# Altium schematic sheet ZYNQ-XC7Z020开发板原理图.SCHDOC
size A0
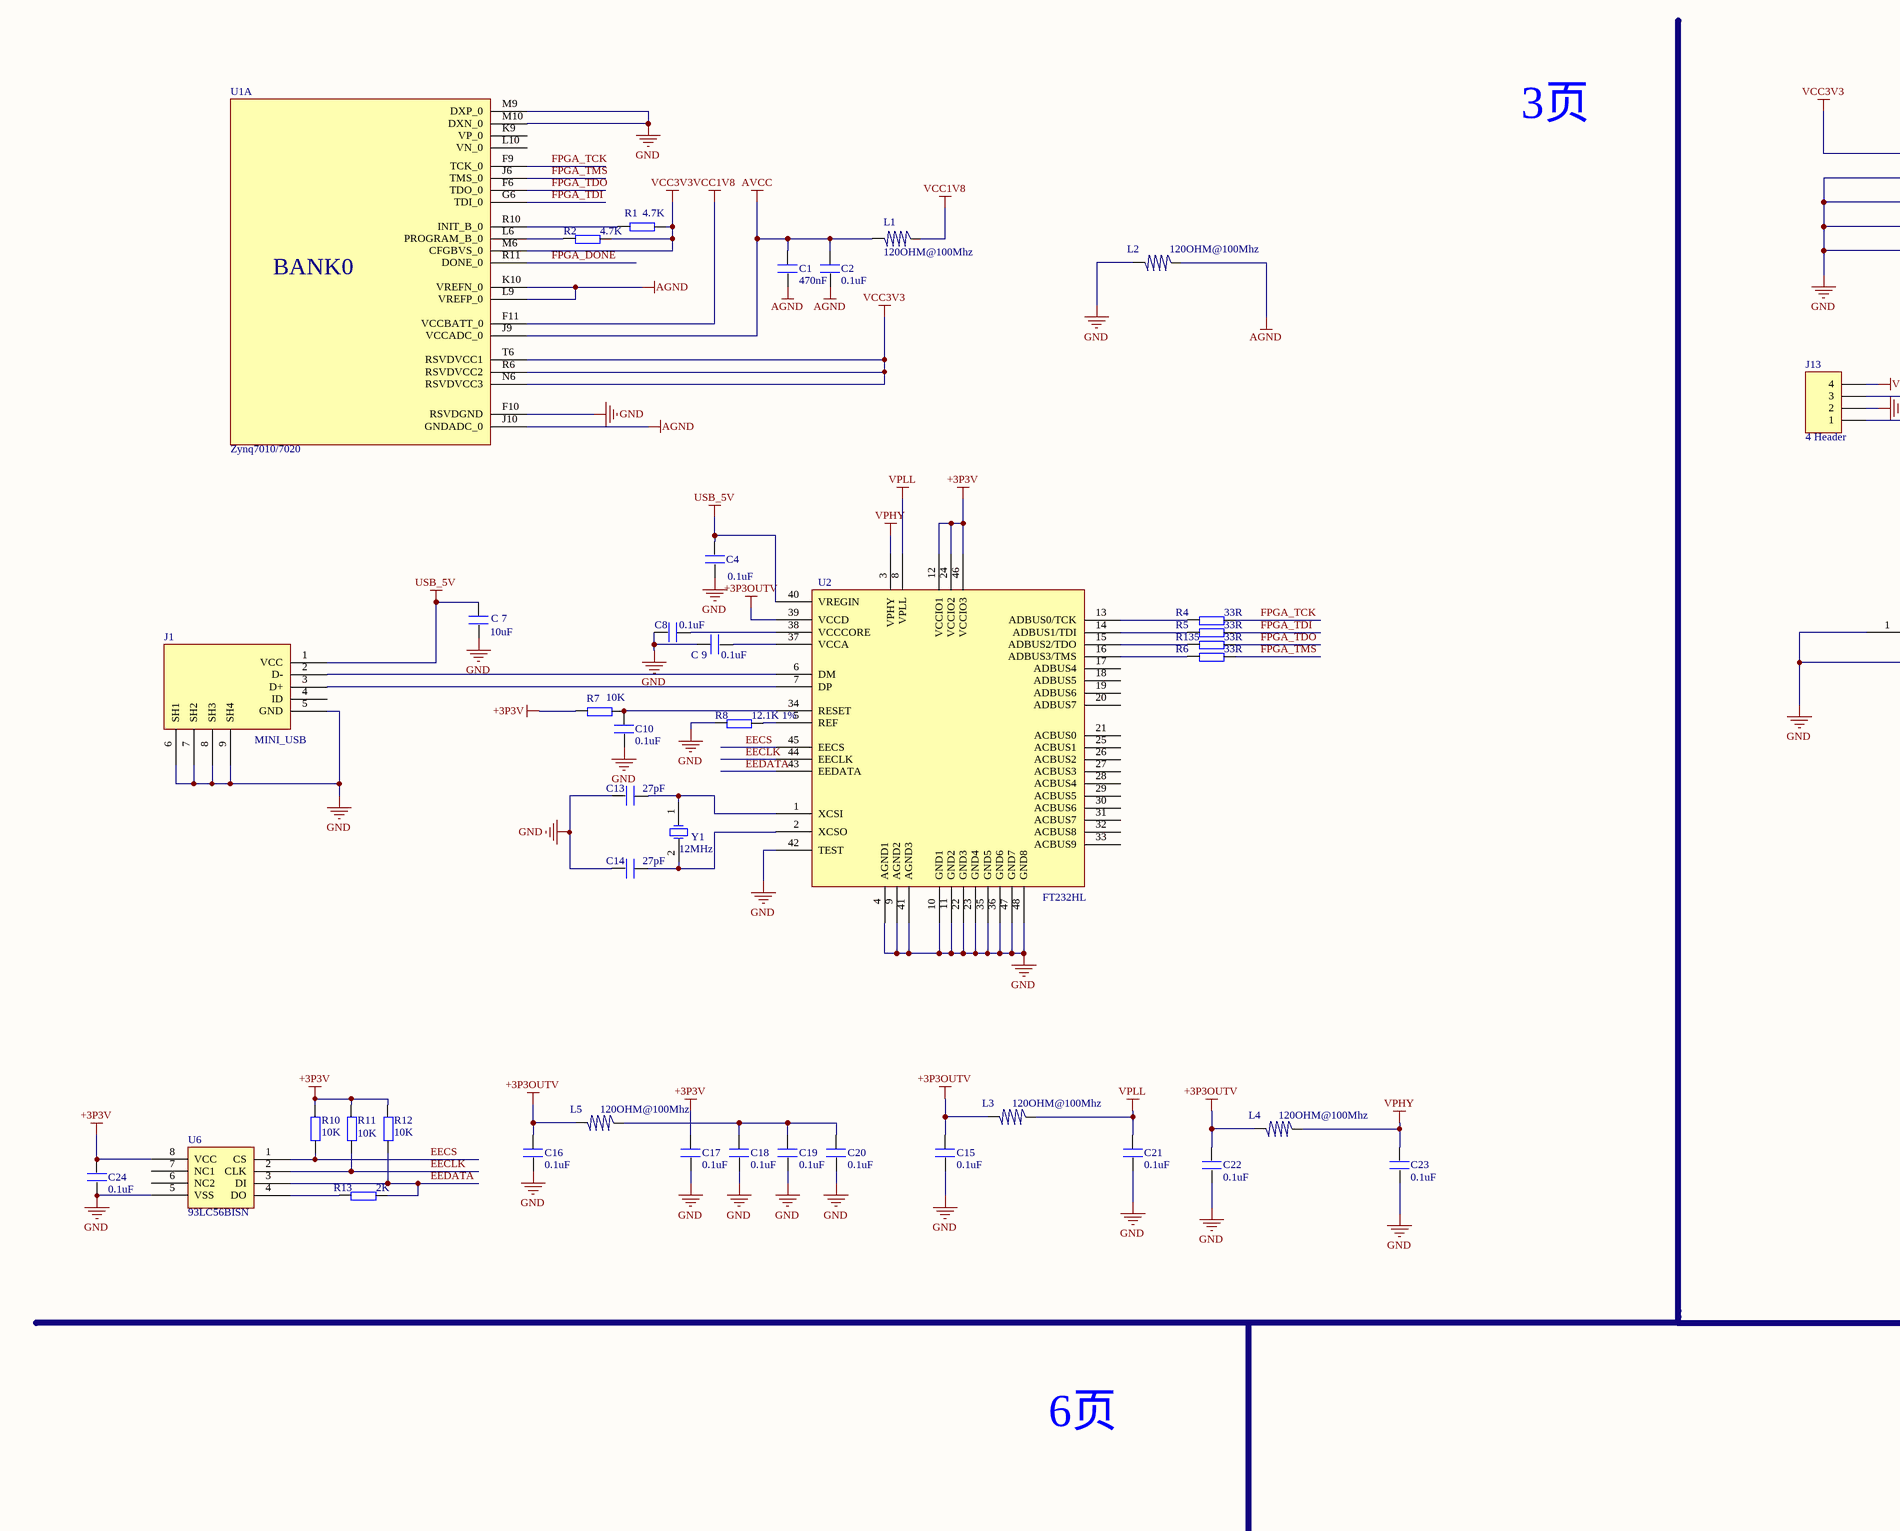
[diagram p0: ZYNQ-XC7Z020开发板原理图.SCHDOC, top left]
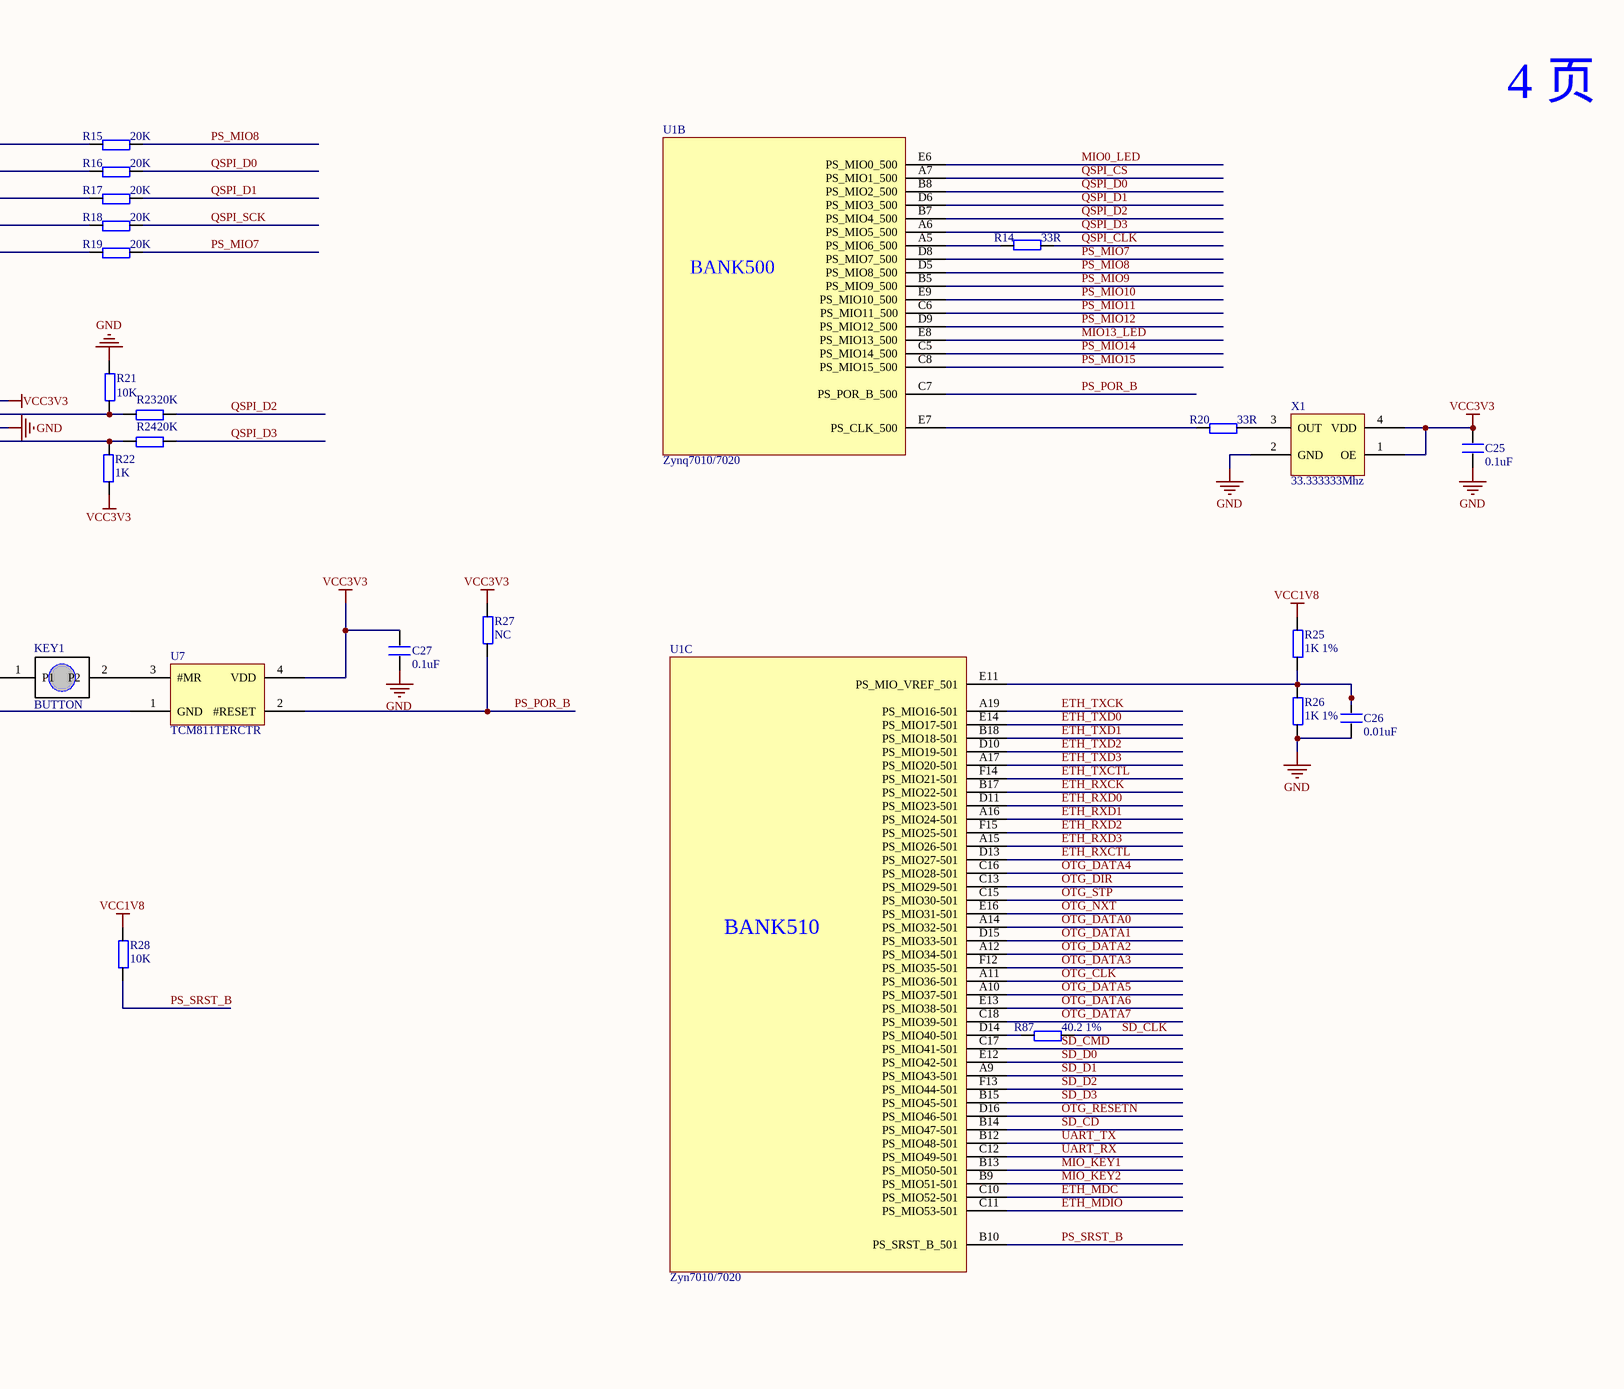
[diagram p1: ZYNQ-XC7Z020开发板原理图.SCHDOC, top middle]
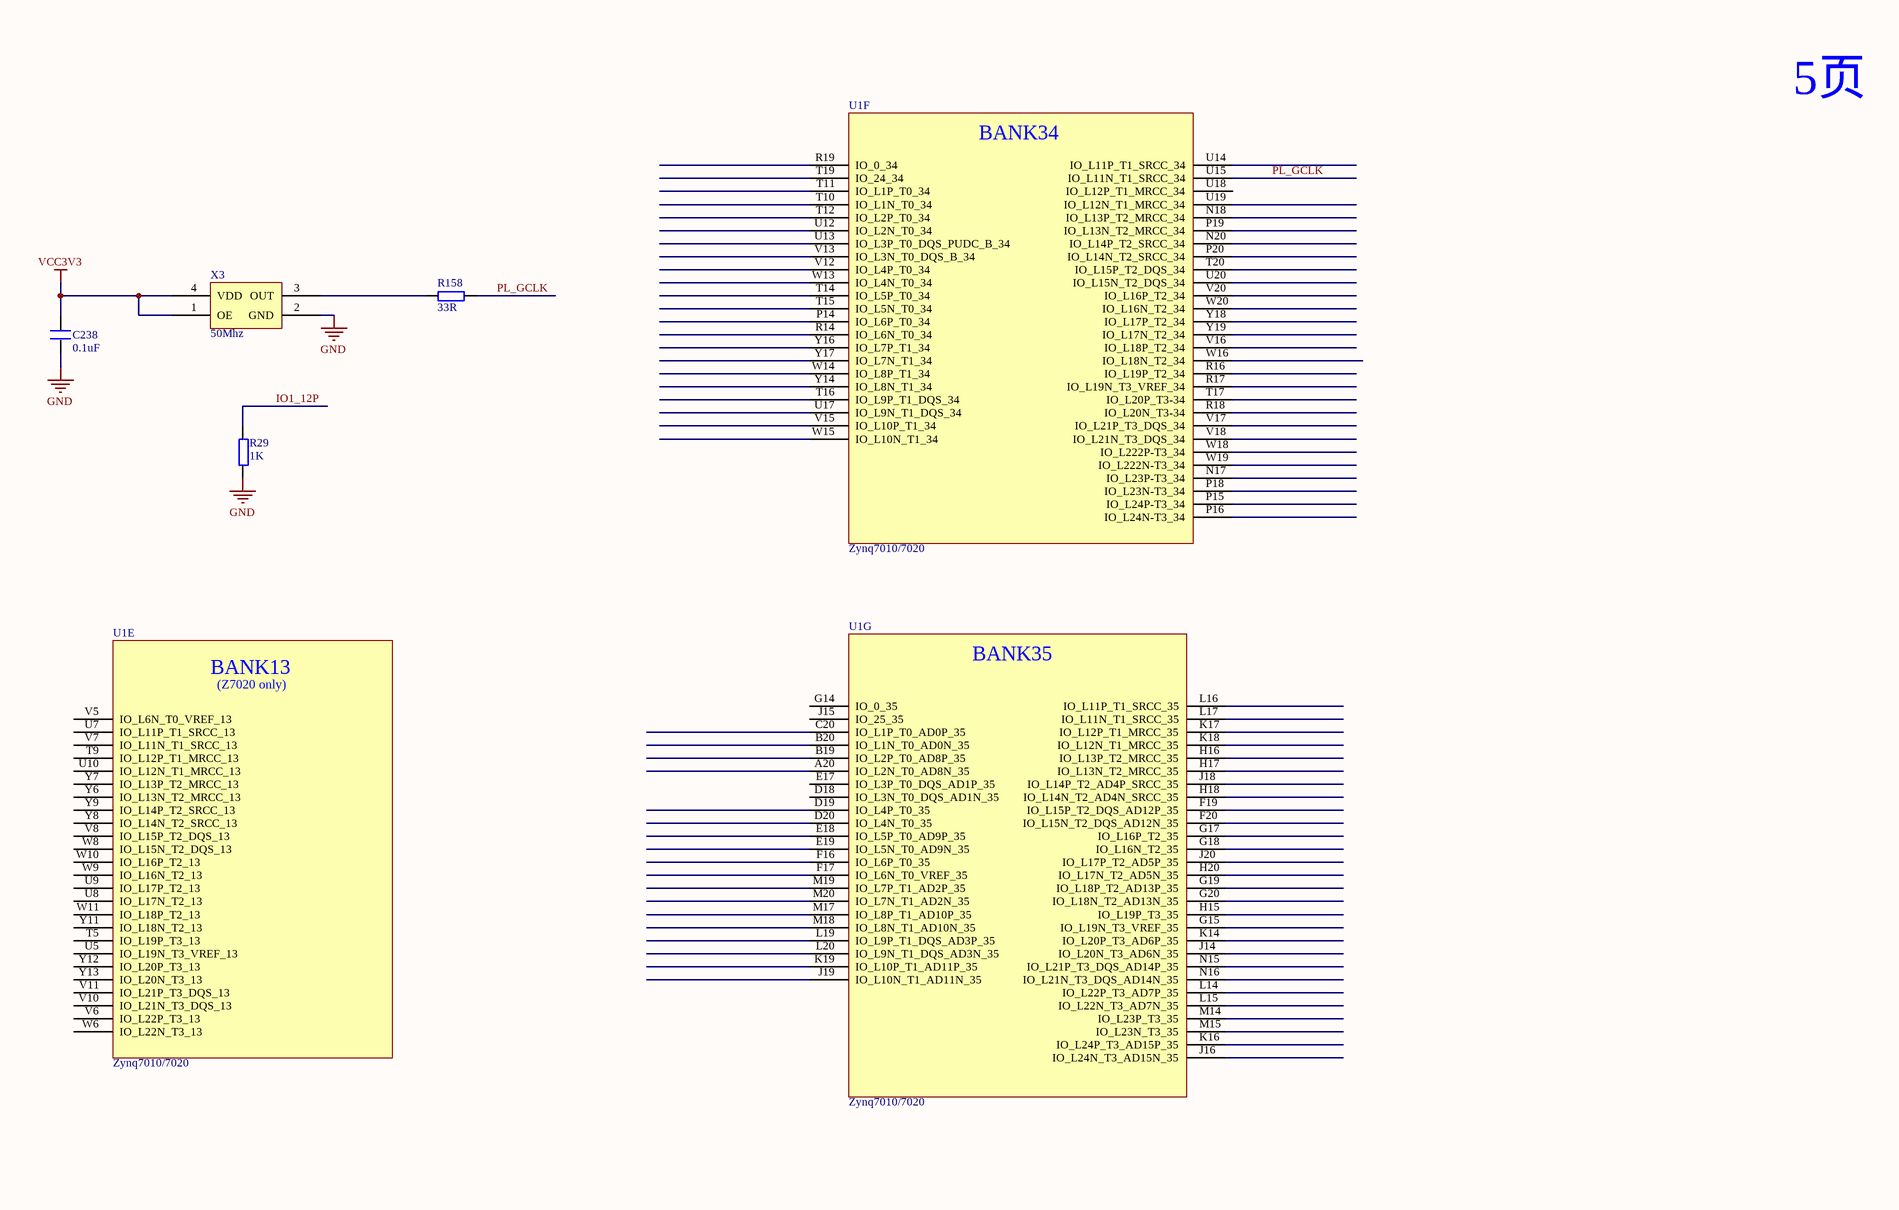
[diagram p2: ZYNQ-XC7Z020开发板原理图.SCHDOC, top right]
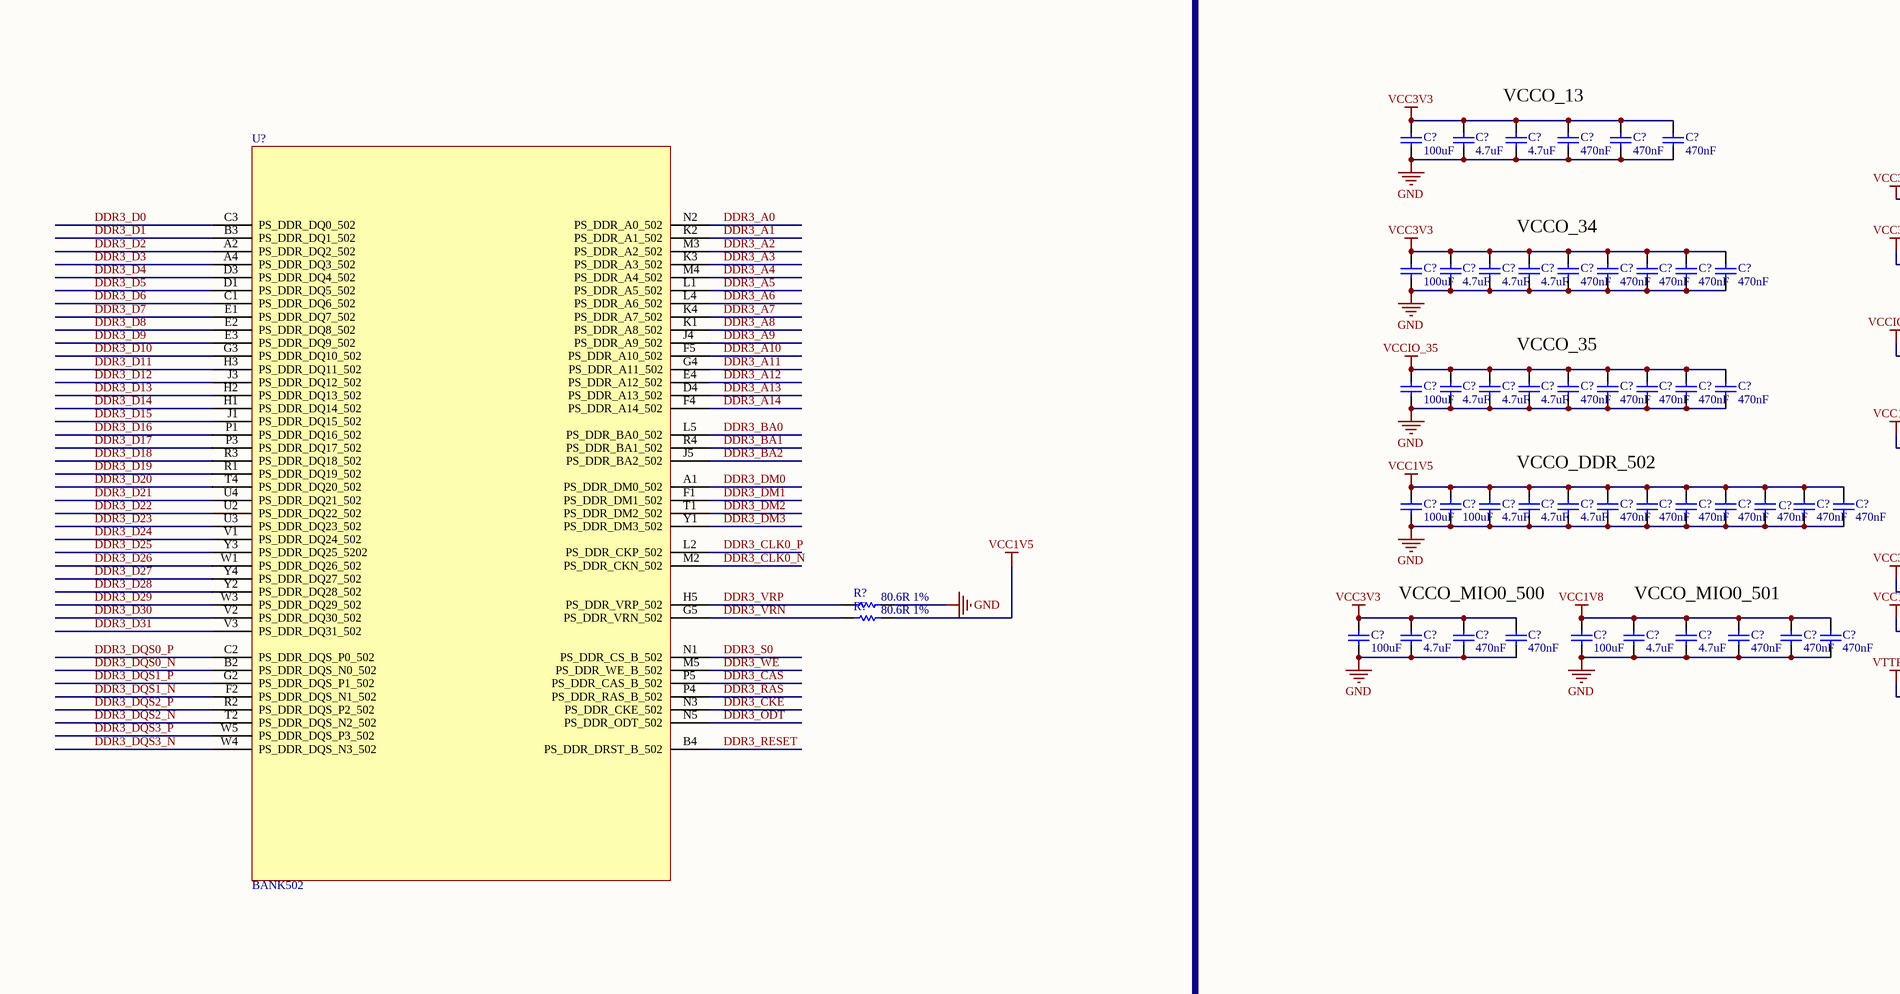
[diagram p3: ZYNQ-XC7Z020开发板原理图.SCHDOC, bottom left]
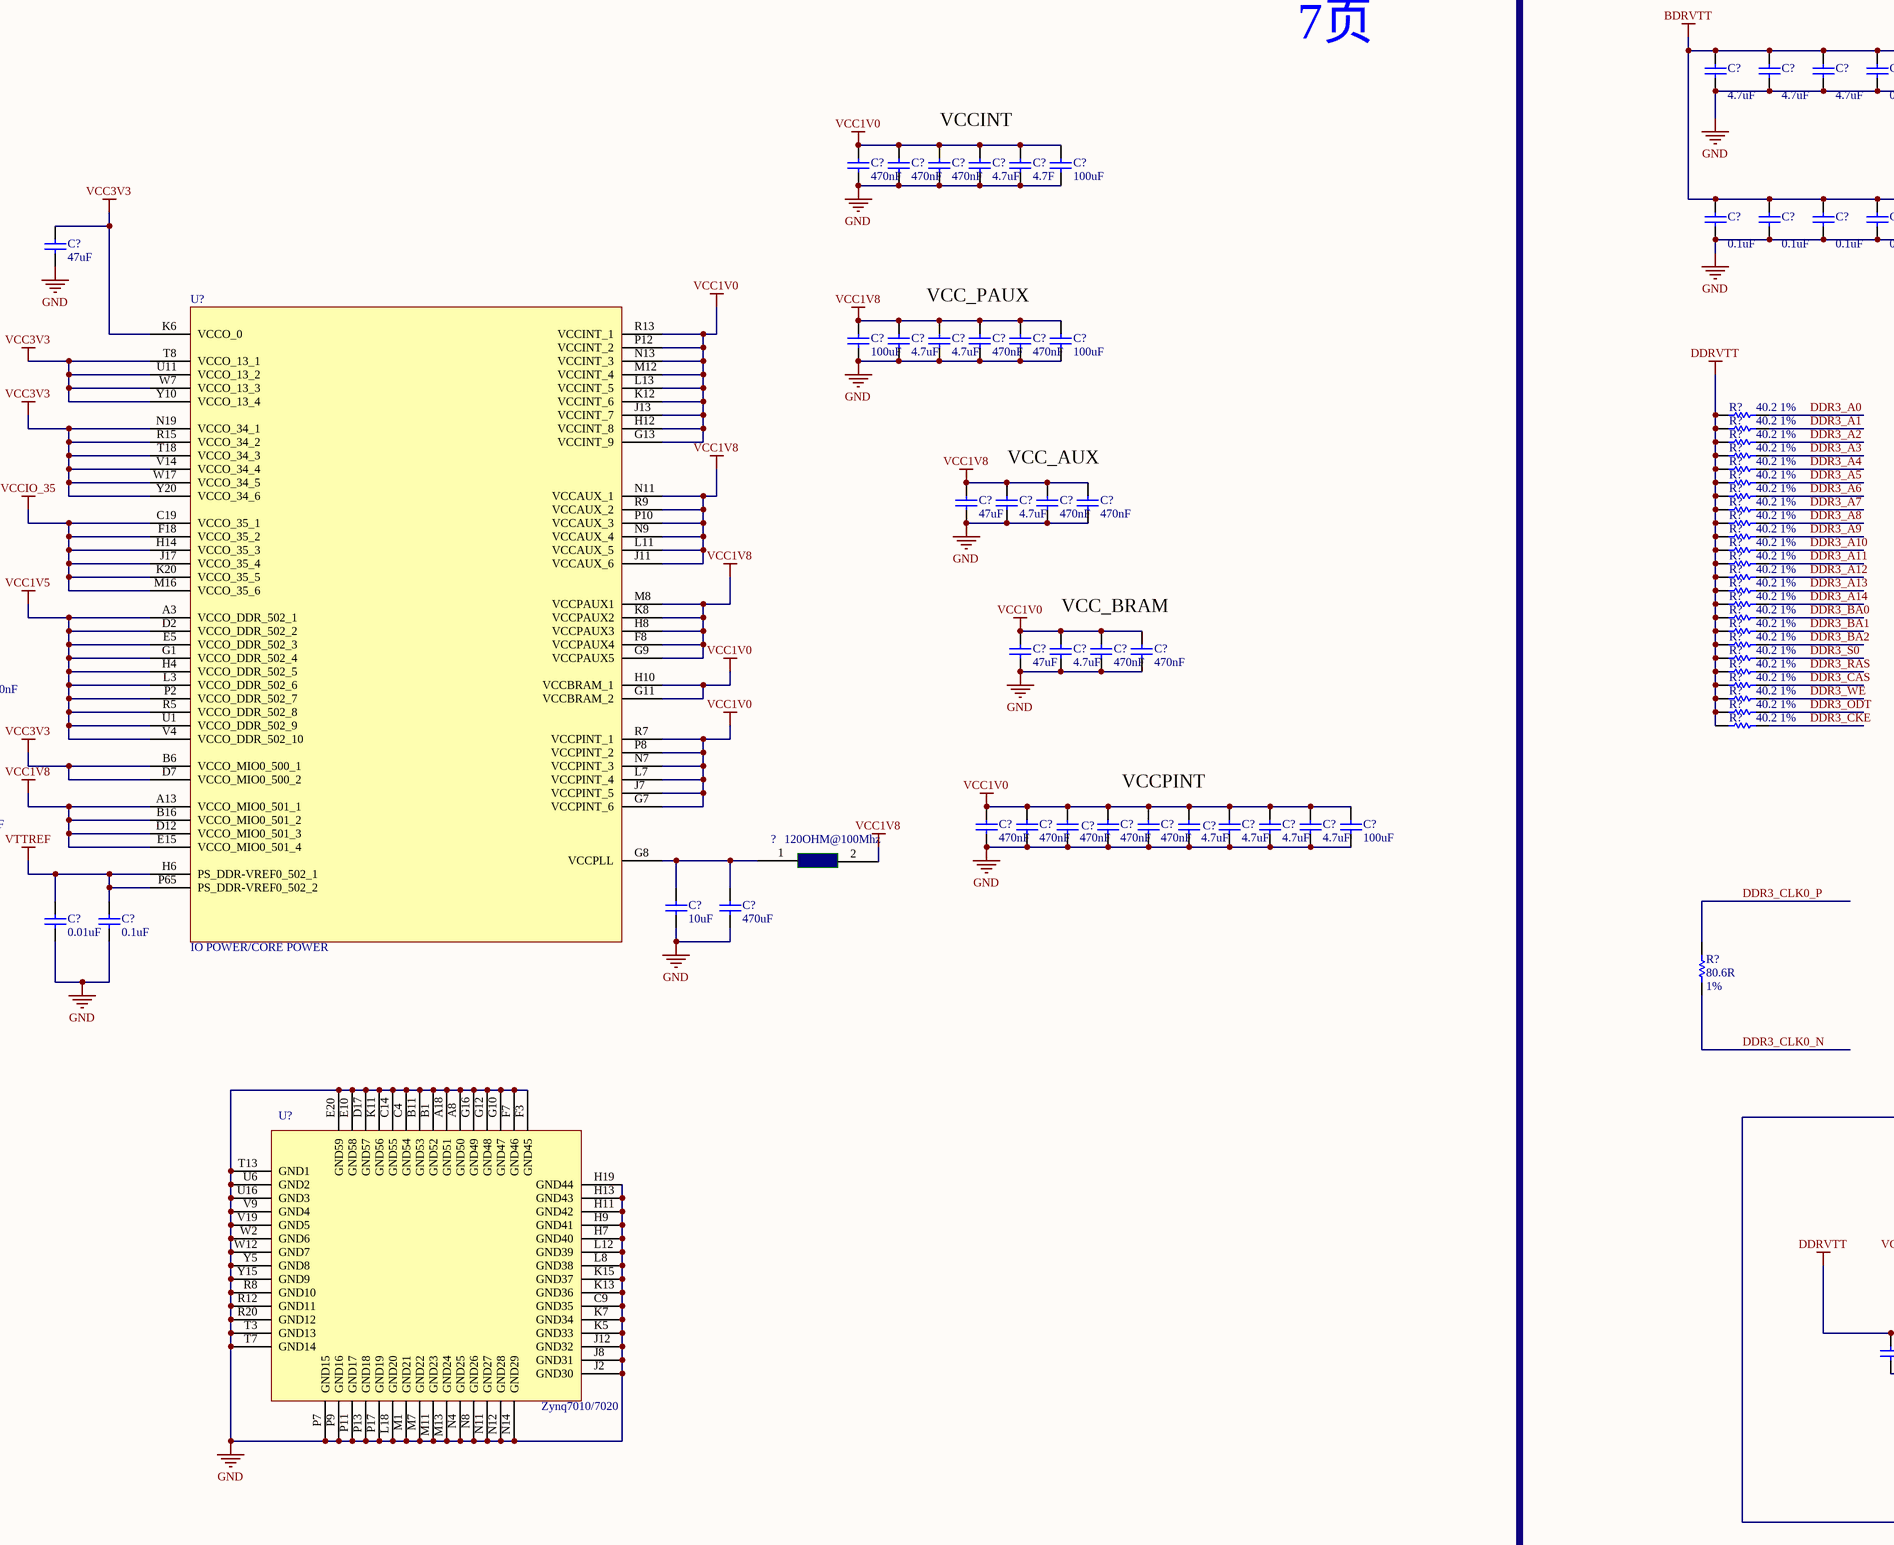
[diagram p4: ZYNQ-XC7Z020开发板原理图.SCHDOC, bottom middle]
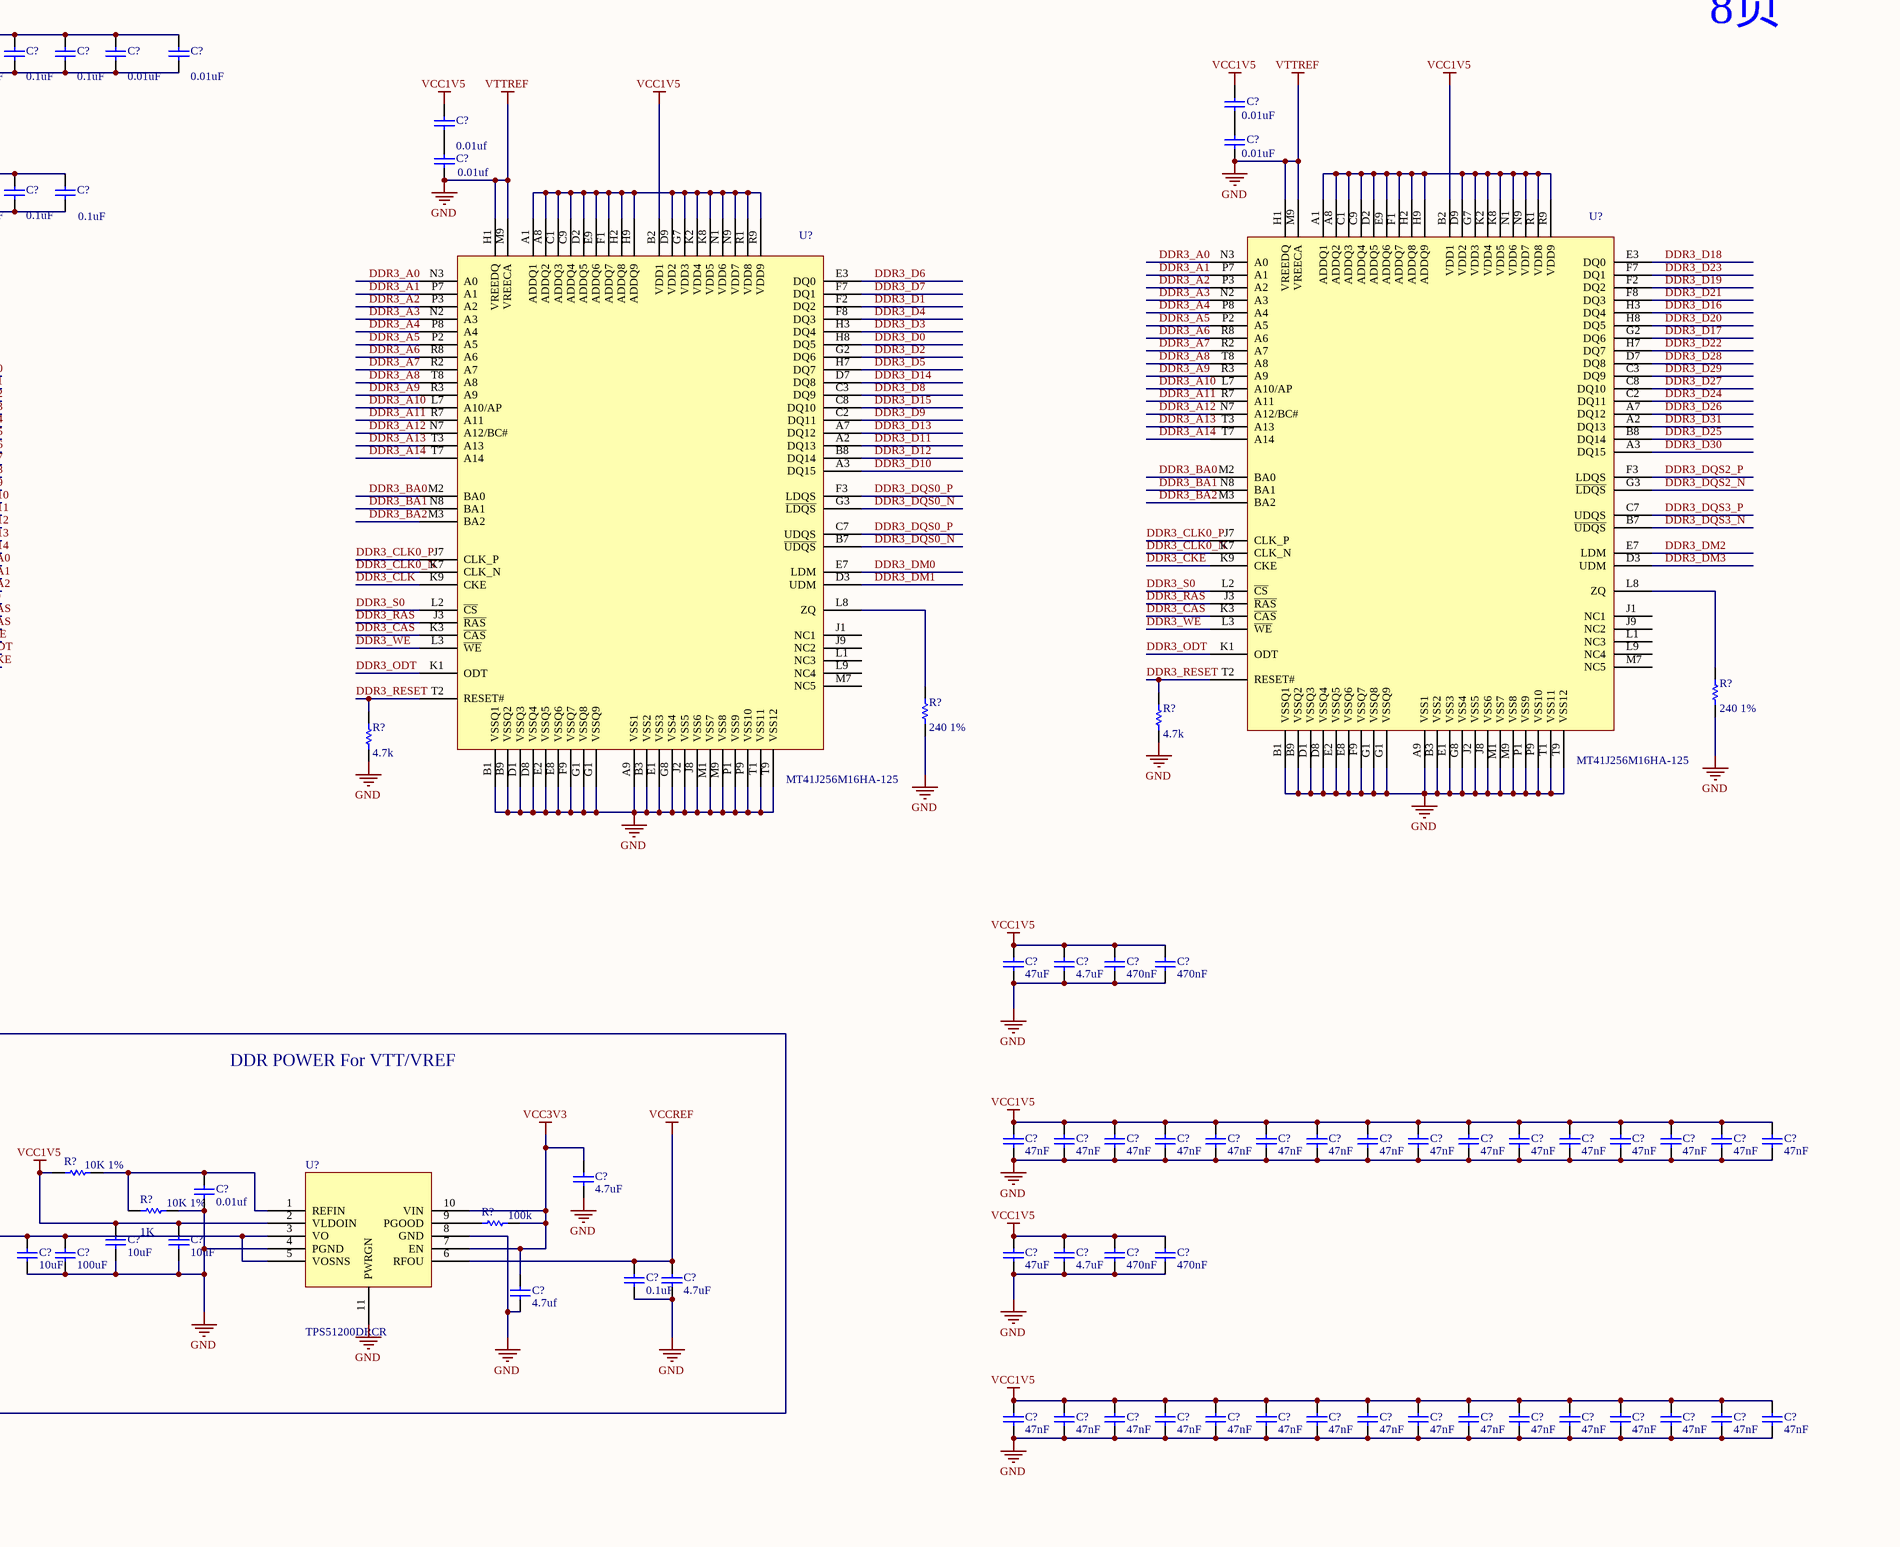
[diagram p5: ZYNQ-XC7Z020开发板原理图.SCHDOC, bottom right]

## Parts
(Parts that share a designator on the sheet are numbered #1, #2 ... from top to bottom, then left to right.)
?  120OHM@100Mhz
C1  470nF  [0603P]
C2  0.1uF  [0603P]
C4  0.1uF  [0603P]
C8  0.1uF  [0603P]
C10  0.1uF  [0603P]
C13  27pF  [0603P]
C14  27pF  [0603P]
C15  0.1uF  [0603P]
C16  0.1uF  [0603P]
C17  0.1uF  [0603P]
C18  0.1uF  [0603P]
C19  0.1uF  [0603P]
C20  0.1uF  [0603P]
C21  0.1uF  [0603P]
C22  0.1uF  [0603P]
C23  0.1uF  [0603P]
C24  0.1uF  [0603P]
C25  0.1uF  [0603P]
C26  0.01uF  [0603P]
C27  0.1uF  [0603P]
C238  0.1uF  [0603P]
C?#1  value 4.7uF  [RAD-0.3]
C?#2  value 4.7uF  [RAD-0.3]
C?#3  value 4.7uF  [RAD-0.3]
C?#4  value 0.1uF  [RAD-0.3]
C?#5  value 0.1uF  [RAD-0.3]
C?#6  value 0.01uF  [RAD-0.3]
C?#7  value 0.01uF  [RAD-0.3]
C?#8  value 0.01uF  [RAD-0.3]
C?#9  value 0.01uf  [RAD-0.3]
C?#10  470nF  [RAD-0.3]
C?#11  470nF  [RAD-0.3]
C?#12  470nF  [RAD-0.3]
C?#13  4.7uF  [RAD-0.3]
C?#14  4.7F  [RAD-0.3]
C?#15  100uF  [RAD-0.3]
C?#16  value 0.01uF  [RAD-0.3]
C?#17  value 0.01uf  [RAD-0.3]
C?#18  value 0.1uF  [RAD-0.3]
C?#19  value 0.1uF  [RAD-0.3]
C?#20  value 0.1uF  [RAD-0.3]
C?#21  value 0.1uF  [RAD-0.3]
C?#22  value 0.1uF  [RAD-0.3]
C?#23  47uF  [RAD-0.3]
C?#24  100uF  [RAD-0.3]
C?#25  4.7uF  [RAD-0.3]
C?#26  4.7uF  [RAD-0.3]
C?#27  470nF  [RAD-0.3]
C?#28  470nF  [RAD-0.3]
C?#29  470nF  [RAD-0.3]
C?#30  100uF  [RAD-0.3]
C?#31  4.7uF  [RAD-0.3]
C?#32  4.7uF  [RAD-0.3]
C?#33  470nF  [RAD-0.3]
C?#34  470nF  [RAD-0.3]
C?#35  100uF  [RAD-0.3]
C?#36  100uF  [RAD-0.3]
C?#37  4.7uF  [RAD-0.3]
C?#38  4.7uF  [RAD-0.3]
C?#39  4.7uF  [RAD-0.3]
C?#40  470nF  [RAD-0.3]
C?#41  470nF  [RAD-0.3]
C?#42  470nF  [RAD-0.3]
C?#43  470nF  [RAD-0.3]
C?#44  470nF  [RAD-0.3]
C?#45  47uF  [RAD-0.3]
C?#46  4.7uF  [RAD-0.3]
C?#47  470nF  [RAD-0.3]
C?#48  470nF  [RAD-0.3]
C?#49  100uF  [RAD-0.3]
C?#50  4.7uF  [RAD-0.3]
C?#51  4.7uF  [RAD-0.3]
C?#52  4.7uF  [RAD-0.3]
C?#53  470nF  [RAD-0.3]
C?#54  470nF  [RAD-0.3]
C?#55  470nF  [RAD-0.3]
C?#56  470nF  [RAD-0.3]
C?#57  470nF  [RAD-0.3]
C?#58  47uF  [RAD-0.3]
C?#59  4.7uF  [RAD-0.3]
C?#60  470nF  [RAD-0.3]
C?#61  470nF  [RAD-0.3]
C?#62  100uF  [RAD-0.3]
C?#63  100uF  [RAD-0.3]
C?#64  4.7uF  [RAD-0.3]
C?#65  4.7uF  [RAD-0.3]
C?#66  4.7uF  [RAD-0.3]
C?#67  470nF  [RAD-0.3]
C?#68  470nF  [RAD-0.3]
C?#69  470nF  [RAD-0.3]
C?#70  470nF  [RAD-0.3]
C?#71  470nF  [RAD-0.3]
C?#72  470nF  [RAD-0.3]
C?#73  470nF  [RAD-0.3]
C?#74  100uF  [RAD-0.3]
C?#75  4.7uF  [RAD-0.3]
C?#76  470nF  [RAD-0.3]
C?#77  470nF  [RAD-0.3]
C?#78  100uF  [RAD-0.3]
C?#79  4.7uF  [RAD-0.3]
C?#80  4.7uF  [RAD-0.3]
C?#81  470nF  [RAD-0.3]
C?#82  470nF  [RAD-0.3]
C?#83  470nF  [RAD-0.3]
C?#84  470nF  [RAD-0.3]
C?#85  470nF  [RAD-0.3]
C?#86  470nF  [RAD-0.3]
C?#87  470nF  [RAD-0.3]
C?#88  470nF  [RAD-0.3]
C?#89  4.7uF  [RAD-0.3]
C?#90  4.7uF  [RAD-0.3]
C?#91  4.7uF  [RAD-0.3]
C?#92  4.7uF  [RAD-0.3]
C?#93  100uF  [RAD-0.3]
C?#94  10uF  [RAD-0.3]
C?#95  470uF  [RAD-0.3]
C?#96  0.01uF  [RAD-0.3]
C?#97  0.1uF  [RAD-0.3]
C?#98  47uF  [RAD-0.3]
C?#99  4.7uF  [RAD-0.3]
C?#100  470nF  [RAD-0.3]
C?#101  470nF  [RAD-0.3]
C?#102  47nF  [RAD-0.3]
C?#103  47nF  [RAD-0.3]
C?#104  47nF  [RAD-0.3]
C?#105  47nF  [RAD-0.3]
C?#106  47nF  [RAD-0.3]
C?#107  47nF  [RAD-0.3]
C?#108  47nF  [RAD-0.3]
C?#109  47nF  [RAD-0.3]
C?#110  47nF  [RAD-0.3]
C?#111  47nF  [RAD-0.3]
C?#112  47nF  [RAD-0.3]
C?#113  47nF  [RAD-0.3]
C?#114  47nF  [RAD-0.3]
C?#115  47nF  [RAD-0.3]
C?#116  47nF  [RAD-0.3]
C?#117  47nF  [RAD-0.3]
C?#118  4.7uF  [RAD-0.3]
C?#119  0.01uf  [RAD-0.3]
C?#120  10uF  [RAD-0.3]
C?#121  10uF  [RAD-0.3]
C?#122  10uF  [RAD-0.3]
C?#123  100uF  [RAD-0.3]
C?#124  47uF  [RAD-0.3]
C?#125  4.7uF  [RAD-0.3]
C?#126  470nF  [RAD-0.3]
C?#127  470nF  [RAD-0.3]
C?#128  0.1uF  [RAD-0.3]
C?#129  4.7uF  [RAD-0.3]
C?#130  4.7uf  [RAD-0.3]
C?#131  47nF  [RAD-0.3]
C?#132  47nF  [RAD-0.3]
C?#133  47nF  [RAD-0.3]
C?#134  47nF  [RAD-0.3]
C?#135  47nF  [RAD-0.3]
C?#136  47nF  [RAD-0.3]
C?#137  47nF  [RAD-0.3]
C?#138  47nF  [RAD-0.3]
C?#139  47nF  [RAD-0.3]
C?#140  47nF  [RAD-0.3]
C?#141  47nF  [RAD-0.3]
C?#142  47nF  [RAD-0.3]
C?#143  47nF  [RAD-0.3]
C?#144  47nF  [RAD-0.3]
C?#145  47nF  [RAD-0.3]
C?#146  47nF  [RAD-0.3]
C_7  10uF  [0603P]
C_9  0.1uF  [0603P]
J1  MINI_USB
J13  4 Header  [HDR1X4]
KEY1  BUTTON
L1  120OHM@100Mhz  [0603P]
L2  120OHM@100Mhz  [0603P]
L3  120OHM@100Mhz  [0603P]
L4  120OHM@100Mhz  [0603P]
L5  120OHM@100Mhz  [0603P]
R1  4.7K  [0603P]
R2  4.7K  [0603P]
R4  33R  [0603P]
R5  33R  [0603P]
R6  33R  [0603P]
R7  10K  [0603P]
R8  12.1K 1%  [0603P]
R10  10K  [0603P]
R11  10K  [0603P]
R12  10K  [0603P]
R13  2K  [0603P]
R14  33R  [0603P]
R15  20K  [0603P]
R16  20K  [0603P]
R17  20K  [0603P]
R18  20K  [0603P]
R19  20K  [0603P]
R20  33R  [0603P]
R21  10K  [0603P]
R22  1K  [0603P]
R23  20K  [0603P]
R24  20K  [0603P]
R25  1K 1%  [0603P]
R26  1K 1%  [0603P]
R27  NC  [0603P]
R28  10K  [0603P]
R29  1K  [0603P]
R87  40.2 1%  [0603P]
R135  33R  [0603P]
R158  33R  [0603P]
R?#1  value 40.2 1%  [AXIAL-0.3]
R?#2  value 40.2 1%  [AXIAL-0.3]
R?#3  value 40.2 1%  [AXIAL-0.3]
R?#4  value 40.2 1%  [AXIAL-0.3]
R?#5  value 40.2 1%  [AXIAL-0.3]
R?#6  value 40.2 1%  [AXIAL-0.3]
R?#7  value 40.2 1%  [AXIAL-0.3]
R?#8  value 40.2 1%  [AXIAL-0.3]
R?#9  value 40.2 1%  [AXIAL-0.3]
R?#10  value 40.2 1%  [AXIAL-0.3]
R?#11  value 40.2 1%  [AXIAL-0.3]
R?#12  value 40.2 1%  [AXIAL-0.3]
R?#13  value 40.2 1%  [AXIAL-0.3]
R?#14  value 40.2 1%  [AXIAL-0.3]
R?#15  value 40.2 1%  [AXIAL-0.3]
R?#16  value 40.2 1%  [AXIAL-0.3]
R?#17  value 40.2 1%  [AXIAL-0.3]
R?#18  value 40.2 1%  [AXIAL-0.3]
R?#19  value 40.2 1%  [AXIAL-0.3]
R?#20  value 40.2 1%  [AXIAL-0.3]
R?#21  value 40.2 1%  [AXIAL-0.3]
R?#22  value 40.2 1%  [AXIAL-0.3]
R?#23  value 40.2 1%  [AXIAL-0.3]
R?#24  value 40.2 1%  [AXIAL-0.3]
R?#25  80.6R 1%  [AXIAL-0.3]
R?#26  value 240 1%  [AXIAL-0.3]
R?#27  80.6R 1%  [AXIAL-0.3]
R?#28  value 240 1%  [AXIAL-0.3]
R?#29  value 4.7k  [AXIAL-0.3]
R?#30  value 4.7k  [AXIAL-0.3]
R?#31  80.6R  value 1%  [AXIAL-0.3]
R?#32  10K 1%  [AXIAL-0.3]
R?#33  10K 1%  value 1K  [AXIAL-0.3]
R?#34  100k  [AXIAL-0.3]
U1A  Zynq7010/7020
U1B  Zynq7010/7020
U1C  Zyn7010/7020
U1E  Zynq7010/7020
U1F  Zynq7010/7020
U1G  Zynq7010/7020
U2  FT232HL
U6  93LC56BISN
U7  TCM811TERCTR
U?#1  MT41J256M16HA-125
U?#2  MT41J256M16HA-125
U?#3  BANK502
U?#4  IO POWER/CORE POWER
U?#5  Zynq7010/7020
U?#6  TPS51200DRCR
X1  33.333333Mhz
X3  50Mhz
Y1  12MHz  [XTAL_US]

## Nets
+3P3OUTV: C15.2 C16.2 C22.2 L3.2 L4.2 L5.2 U2.39(VCCD)
+3P3V: C17.2 C24.2 R7.1 R10.2 R11.2 R12.2 U2.12(VCCIO1) U2.24(VCCIO2) U2.46(VCCIO3) U6.8(VCC)
AGND: C1.1 C2.1 L2.1 U1A.J10(GNDADC_0) U1A.K10(VREFN_0) U1A.L9(VREFP_0)
AVCC: C1.2 C2.2 L1.2 U1A.J9(VCCADC_0)
BDRVTT: C?#1.2 C?#2.2 C?#3.2 C?#4.2 C?#5.2 C?#6.2 C?#7.2 C?#18.2 C?#19.2 C?#20.2 C?#21.2 C?#22.2
DDRVTT: C?#122.2 C?#123.2 R?#1.1 R?#2.1 R?#3.1 R?#4.1 R?#5.1 R?#6.1 R?#7.1 R?#8.1 R?#9.1 R?#10.1 R?#11.1 R?#12.1 R?#13.1 R?#14.1 R?#15.1 R?#16.1 R?#17.1 R?#18.1 R?#19.1 R?#20.1 R?#21.1 R?#22.1 R?#23.1 R?#24.1 U?#6.3(VO) U?#6.5(VOSNS)
GND: C4.1 C8.2 C10.1 C13.2 C14.2 C15.1 C16.1 C17.1 C18.1 C19.1 C20.1 C21.1 C22.1 C23.1 C24.1 C25.1 C26.1 C27.1 C238.1 C?#1.1 C?#2.1 C?#3.1 C?#4.1 C?#5.1 C?#6.1 C?#7.1 C?#10.1 C?#11.1 C?#12.1 C?#13.1 C?#14.1 C?#15.1 C?#16.1 C?#17.1 C?#18.1 C?#19.1 C?#20.1 C?#21.1 C?#22.1 C?#23.1 C?#24.1 C?#25.1 C?#26.1 C?#27.1 C?#28.1 C?#29.1 C?#30.1 C?#31.1 C?#32.1 C?#33.1 C?#34.1 C?#35.1 C?#36.1 C?#37.1 C?#38.1 C?#39.1 C?#40.1 C?#41.1 C?#42.1 C?#43.1 C?#44.1 C?#45.1 C?#46.1 C?#47.1 C?#48.1 C?#49.1 C?#50.1 C?#51.1 C?#52.1 C?#53.1 C?#54.1 C?#55.1 C?#56.1 C?#57.1 C?#58.1 C?#59.1 C?#60.1 C?#61.1 C?#62.1 C?#63.1 C?#64.1 C?#65.1 C?#66.1 C?#67.1 C?#68.1 C?#69.1 C?#70.1 C?#71.1 C?#72.1 C?#73.1 C?#74.1 C?#75.1 C?#76.1 C?#77.1 C?#78.1 C?#79.1 C?#80.1 C?#81.1 C?#82.1 C?#83.1 C?#84.1 C?#85.1 C?#86.1 C?#87.1 C?#88.1 C?#89.1 C?#90.1 C?#91.1 C?#92.1 C?#93.1 C?#94.1 C?#95.1 C?#96.1 C?#96.2 C?#97.1 C?#97.2 C?#98.1 C?#99.1 C?#100.1 C?#101.1 C?#102.1 C?#103.1 C?#104.1 C?#105.1 C?#106.1 C?#107.1 C?#108.1 C?#109.1 C?#110.1 C?#111.1 C?#112.1 C?#113.1 C?#114.1 C?#115.1 C?#116.1 C?#117.1 C?#118.1 C?#119.1 C?#120.1 C?#121.1 C?#122.1 C?#123.1 C?#124.1 C?#125.1 C?#126.1 C?#127.1 C?#128.1 C?#129.1 C?#130.1 C?#131.1 C?#132.1 C?#133.1 C?#134.1 C?#135.1 C?#136.1 C?#137.1 C?#138.1 C?#139.1 C?#140.1 C?#141.1 C?#142.1 C?#143.1 C?#144.1 C?#145.1 C?#146.1 C_7.1 C_9.1 J1.5(GND) J1.6(SH1) J1.7(SH2) J1.8(SH3) J1.9(SH4) J13.2 KEY1.1(P1) L2.2 R8.1 R16.1 R17.1 R18.1 R19.1 R21.2 R26.1 R29.1 R?#25.2 R?#26.1 R?#28.1 R?#29.1 R?#30.1 R?#33.2 U1A.F10(RSVDGND) U1A.M9(DXP_0) U1A.M10(DXN_0) U2.4(AGND1) U2.9(AGND2) U2.10(GND1) U2.11(GND2) U2.22(GND3) U2.23(GND4) U2.35(GND5) U2.36(GND6) U2.41(AGND3) U2.42(TEST) U2.47(GND7) U2.48(GND8) U6.5(VSS) U7.1(GND) U?#1.A9(VSS1) U?#1.B1(VSSQ1) U?#1.B3(VSS2) U?#1.B9(VSSQ2) U?#1.D1(VSSQ3) U?#1.D8(VSSQ4) U?#1.E1(VSS3) U?#1.E2(VSSQ5) U?#1.E8(VSSQ6) U?#1.F9(VSSQ7) U?#1.G1(VSSQ8) U?#1.G8(VSS4) U?#1.H1(VREEDQ) U?#1.J2(VSS5) U?#1.J8(VSS6) U?#1.M1(VSS7) U?#1.M9(VSS8) U?#1.P1(VSS9) U?#1.P9(VSS10) U?#1.T1(VSS11) U?#1.T9(VSS12) U?#2.A9(VSS1) U?#2.B1(VSSQ1) U?#2.B3(VSS2) U?#2.B9(VSSQ2) U?#2.D1(VSSQ3) U?#2.D8(VSSQ4) U?#2.E1(VSS3) U?#2.E2(VSSQ5) U?#2.E8(VSSQ6) U?#2.F9(VSSQ7) U?#2.G1(VSSQ8) U?#2.G8(VSS4) U?#2.H1(VREEDQ) U?#2.J2(VSS5) U?#2.J8(VSS6) U?#2.M1(VSS7) U?#2.M9(VSS8) U?#2.P1(VSS9) U?#2.P9(VSS10) U?#2.T1(VSS11) U?#2.T9(VSS12) U?#4.H6(PS_DDR-VREF0_502_1) U?#4.P65(PS_DDR-VREF0_502_2) U?#5.A8(GND50) U?#5.A18(GND51) U?#5.B1(GND52) U?#5.B11(GND53) U?#5.C4(GND54) U?#5.C9(GND35) U?#5.C14(GND55) U?#5.D17(GND57) U?#5.E10(GND58) U?#5.E20(GND59) U?#5.F3(GND45) U?#5.F7(GND46) U?#5.G10(GND47) U?#5.G12(GND48) U?#5.G16(GND49) U?#5.H7(GND40) U?#5.H9(GND41) U?#5.H11(GND42) U?#5.H13(GND43) U?#5.H19(GND44) U?#5.J2(GND30) U?#5.J8(GND31) U?#5.J12(GND32) U?#5.K5(GND33) U?#5.K7(GND34) U?#5.K11(GND56) U?#5.K13(GND36) U?#5.K15(GND37) U?#5.L8(GND38) U?#5.L12(GND39) U?#5.L18(GND20) U?#5.M1(GND21) U?#5.M7(GND22) U?#5.M11(GND23) U?#5.M13(GND24) U?#5.N4(GND25) U?#5.N8(GND26) U?#5.N11(GND27) U?#5.N12(GND28) U?#5.N14(GND29) U?#5.P7(GND15) U?#5.P9(GND16) U?#5.P11(GND17) U?#5.P13(GND18) U?#5.P17(GND19) U?#5.R8(GND10) U?#5.R12(GND11) U?#5.R20(GND12) U?#5.T3(GND13) U?#5.T7(GND14) U?#5.T13(GND1) U?#5.U6(GND2) U?#5.U16(GND3) U?#5.V9(GND4) U?#5.V19(GND5) U?#5.W2(GND6) U?#5.W12(GND7) U?#5.Y5(GND8) U?#5.Y15(GND9) U?#6.4(PGND) U?#6.8(GND) U?#6.11(PWRGN) X1.2(GND) X3.2(GND)  [also labelled VTTREF]
USB_5V: C4.2 C_7.2 J1.1(VCC) U2.40(VREGIN)
VCC1V0: C?#10.2 C?#11.2 C?#12.2 C?#13.2 C?#14.2 C?#15.2 C?#58.2 C?#59.2 C?#60.2 C?#61.2 C?#84.2 C?#85.2 C?#86.2 C?#87.2 C?#88.2 C?#89.2 C?#90.2 C?#91.2 C?#92.2 C?#93.2 U?#4.G7(VCCPINT_6) U?#4.G11(VCCBRAM_2) U?#4.G13(VCCINT_9) U?#4.H10(VCCBRAM_1) U?#4.H12(VCCINT_8) U?#4.J7(VCCPINT_5) U?#4.J13(VCCINT_7) U?#4.K12(VCCINT_6) U?#4.L7(VCCPINT_4) U?#4.L13(VCCINT_5) U?#4.M12(VCCINT_4) U?#4.N7(VCCPINT_3) U?#4.N13(VCCINT_3) U?#4.P8(VCCPINT_2) U?#4.P12(VCCINT_2) U?#4.R7(VCCPINT_1) U?#4.R13(VCCINT_1)
VCC1V5: C?#8.2 C?#9.2 C?#62.2 C?#63.2 C?#64.2 C?#65.2 C?#66.2 C?#67.2 C?#68.2 C?#69.2 C?#70.2 C?#71.2 C?#72.2 C?#73.2 C?#98.2 C?#99.2 C?#100.2 C?#101.2 C?#102.2 C?#103.2 C?#104.2 C?#105.2 C?#106.2 C?#107.2 C?#108.2 C?#109.2 C?#110.2 C?#111.2 C?#112.2 C?#113.2 C?#114.2 C?#115.2 C?#116.2 C?#117.2 C?#120.2 C?#121.2 C?#124.2 C?#125.2 C?#126.2 C?#127.2 C?#131.2 C?#132.2 C?#133.2 C?#134.2 C?#135.2 C?#136.2 C?#137.2 C?#138.2 C?#139.2 C?#140.2 C?#141.2 C?#142.2 C?#143.2 C?#144.2 C?#145.2 C?#146.2 R?#27.2 R?#32.1 U?#1.B2(VDD1) U?#2.B2(VDD1) U?#4.A3(VCCO_DDR_502_1) U?#4.D2(VCCO_DDR_502_2) U?#4.E5(VCCO_DDR_502_3) U?#4.G1(VCCO_DDR_502_4) U?#4.H4(VCCO_DDR_502_5) U?#4.L3(VCCO_DDR_502_6) U?#4.P2(VCCO_DDR_502_7) U?#4.R5(VCCO_DDR_502_8) U?#4.U1(VCCO_DDR_502_9) U?#4.V4(VCCO_DDR_502_10) U?#6.2(VLDOIN)
VCC1V8: ?.2 C?#30.2 C?#31.2 C?#32.2 C?#33.2 C?#34.2 C?#35.2 C?#45.2 C?#46.2 C?#47.2 C?#48.2 C?#78.2 C?#79.2 C?#80.2 C?#81.2 C?#82.2 C?#83.2 L1.1 R25.2 R28.2 U1A.F11(VCCBATT_0) U?#4.A13(VCCO_MIO0_501_1) U?#4.B16(VCCO_MIO0_501_2) U?#4.D12(VCCO_MIO0_501_3) U?#4.E15(VCCO_MIO0_501_4) U?#4.F8(VCCPAUX4) U?#4.G9(VCCPAUX5) U?#4.H8(VCCPAUX3) U?#4.J11(VCCAUX_6) U?#4.K8(VCCPAUX2) U?#4.L11(VCCAUX_5) U?#4.M8(VCCPAUX1) U?#4.N9(VCCAUX_4) U?#4.N11(VCCAUX_1) U?#4.P10(VCCAUX_3) U?#4.R9(VCCAUX_2)
VCC3V3: C25.2 C27.2 C238.2 C?#23.2 C?#24.2 C?#25.2 C?#26.2 C?#27.2 C?#28.2 C?#29.2 C?#36.2 C?#37.2 C?#38.2 C?#39.2 C?#40.2 C?#41.2 C?#42.2 C?#43.2 C?#44.2 C?#74.2 C?#75.2 C?#76.2 C?#77.2 C?#118.2 C?#130.2 J13.4 R1.2 R2.2 R15.1 R22.2 R27.2 R?#34.2 U1A.M6(CFGBVS_0) U1A.N6(RSVDVCC3) U1A.R6(RSVDVCC2) U1A.T6(RSVDVCC1) U7.4(VDD) U?#4.B6(VCCO_MIO0_500_1) U?#4.D7(VCCO_MIO0_500_2) U?#4.K6(VCCO_0) U?#4.N19(VCCO_34_1) U?#4.R15(VCCO_34_2) U?#4.T8(VCCO_13_1) U?#4.T18(VCCO_34_3) U?#4.U11(VCCO_13_2) U?#4.V14(VCCO_34_4) U?#4.W7(VCCO_13_3) U?#4.W17(VCCO_34_5) U?#4.Y10(VCCO_13_4) U?#4.Y20(VCCO_34_6) U?#6.7(EN) U?#6.10(VIN) X1.1(OE) X1.4(VDD) X3.1(OE) X3.4(VDD)
VCCIO_35: C?#49.2 C?#50.2 C?#51.2 C?#52.2 C?#53.2 C?#54.2 C?#55.2 C?#56.2 C?#57.2 U?#4.C19(VCCO_35_1) U?#4.F18(VCCO_35_2) U?#4.H14(VCCO_35_3) U?#4.J17(VCCO_35_4) U?#4.K20(VCCO_35_5) U?#4.M16(VCCO_35_6)
VCCREF: C?#128.2 C?#129.2 U?#6.6(RFOU)
VPHY: C23.2 L4.1 U2.3(VPHY)
VPLL: C21.2 L3.1 U2.8(VPLL)
DDR3_A0: R?#1.2 U?#1.N3(A0) U?#2.N3(A0) U?#3.N2(PS_DDR_A0_502)
DDR3_A1: R?#2.2 U?#1.P7(A1) U?#2.P7(A1) U?#3.K2(PS_DDR_A1_502)
DDR3_A2: R?#3.2 U?#1.P3(A2) U?#2.P3(A2) U?#3.M3(PS_DDR_A2_502)
DDR3_A3: R?#4.2 U?#1.N2(A3) U?#2.N2(A3) U?#3.K3(PS_DDR_A3_502)
DDR3_A4: R?#5.2 U?#1.P8(A4) U?#2.P8(A4) U?#3.M4(PS_DDR_A4_502)
DDR3_A5: R?#6.2 U?#1.P2(A5) U?#2.P2(A5) U?#3.L1(PS_DDR_A5_502)
DDR3_A6: R?#7.2 U?#1.R8(A6) U?#2.R8(A6) U?#3.L4(PS_DDR_A6_502)
DDR3_A7: R?#8.2 U?#1.R2(A7) U?#2.R2(A7) U?#3.K4(PS_DDR_A7_502)
DDR3_A8: R?#9.2 U?#1.T8(A8) U?#2.T8(A8) U?#3.K1(PS_DDR_A8_502)
DDR3_A9: R?#10.2 U?#1.R3(A9) U?#2.R3(A9) U?#3.J4(PS_DDR_A9_502)
DDR3_A10: R?#11.2 U?#1.L7(A10/AP) U?#2.L7(A10/AP) U?#3.F5(PS_DDR_A10_502)
DDR3_A11: R?#12.2 U?#1.R7(A11) U?#2.R7(A11) U?#3.G4(PS_DDR_A11_502)
DDR3_A12: R?#13.2 U?#1.N7(A12/BC#) U?#2.N7(A12/BC#) U?#3.E4(PS_DDR_A12_502)
DDR3_A13: R?#14.2 U?#1.T3(A13) U?#2.T3(A13) U?#3.D4(PS_DDR_A13_502)
DDR3_A14: R?#15.2 U?#1.T7(A14) U?#2.T7(A14) U?#3.F4(PS_DDR_A14_502)
DDR3_BA0: R?#16.2 U?#1.M2(BA0) U?#2.M2(BA0) U?#3.L5(PS_DDR_BA0_502)
DDR3_BA1: R?#17.2 U?#1.N8(BA1) U?#2.N8(BA1) U?#3.R4(PS_DDR_BA1_502)
DDR3_BA2: R?#18.2 U?#1.M3(BA2) U?#2.M3(BA2) U?#3.J5(PS_DDR_BA2_502)
DDR3_CAS: R?#21.2 U?#1.K3(~{CAS}) U?#2.K3(~{CAS}) U?#3.P5(PS_DDR_CAS_B_502)
DDR3_CKE: R?#24.2 U?#1.K9(CKE) U?#3.N3(PS_DDR_CKE_502)
DDR3_CLK: U?#2.K9(CKE)
DDR3_CLK0_N: R?#31.1 U?#1.K7(CLK_N) U?#2.K7(CLK_N) U?#3.M2(PS_DDR_CKN_502)
DDR3_CLK0_P: R?#31.2 U?#1.J7(CLK_P) U?#2.J7(CLK_P) U?#3.L2(PS_DDR_CKP_502)
DDR3_D0: U?#2.H8(DQ5) U?#3.C3(PS_DDR_DQ0_502)
DDR3_D1: U?#2.F2(DQ2) U?#3.B3(PS_DDR_DQ1_502)
DDR3_D2: U?#2.G2(DQ6) U?#3.A2(PS_DDR_DQ2_502)
DDR3_D3: U?#2.H3(DQ4) U?#3.A4(PS_DDR_DQ3_502)
DDR3_D4: U?#2.F8(DQ3) U?#3.D3(PS_DDR_DQ4_502)
DDR3_D5: U?#2.H7(DQ7) U?#3.D1(PS_DDR_DQ5_502)
DDR3_D6: U?#2.E3(DQ0) U?#3.C1(PS_DDR_DQ6_502)
DDR3_D7: U?#2.F7(DQ1) U?#3.E1(PS_DDR_DQ7_502)
DDR3_D8: U?#2.C3(DQ9) U?#3.E2(PS_DDR_DQ8_502)
DDR3_D9: U?#2.C2(DQ11) U?#3.E3(PS_DDR_DQ9_502)
DDR3_D10: U?#2.A3(DQ15) U?#3.G3(PS_DDR_DQ10_502)
DDR3_D11: U?#2.A2(DQ13) U?#3.H3(PS_DDR_DQ11_502)
DDR3_D12: U?#2.B8(DQ14) U?#3.J3(PS_DDR_DQ12_502)
DDR3_D13: U?#2.A7(DQ12) U?#3.H2(PS_DDR_DQ13_502)
DDR3_D14: U?#2.D7(DQ8) U?#3.H1(PS_DDR_DQ14_502)
DDR3_D15: U?#2.C8(DQ10) U?#3.J1(PS_DDR_DQ15_502)
DDR3_D16: U?#1.H3(DQ4) U?#3.P1(PS_DDR_DQ16_502)
DDR3_D17: U?#1.G2(DQ6) U?#3.P3(PS_DDR_DQ17_502)
DDR3_D18: U?#1.E3(DQ0) U?#3.R3(PS_DDR_DQ18_502)
DDR3_D19: U?#1.F2(DQ2) U?#3.R1(PS_DDR_DQ19_502)
DDR3_D20: U?#1.H8(DQ5) U?#3.T4(PS_DDR_DQ20_502)
DDR3_D21: U?#1.F8(DQ3) U?#3.U4(PS_DDR_DQ21_502)
DDR3_D22: U?#1.H7(DQ7) U?#3.U2(PS_DDR_DQ22_502)
DDR3_D23: U?#1.F7(DQ1) U?#3.U3(PS_DDR_DQ23_502)
DDR3_D24: U?#1.C2(DQ11) U?#3.V1(PS_DDR_DQ24_502)
DDR3_D25: U?#1.B8(DQ14) U?#3.Y3(PS_DDR_DQ25_5202)
DDR3_D26: U?#1.A7(DQ12) U?#3.W1(PS_DDR_DQ26_502)
DDR3_D27: U?#1.C8(DQ10) U?#3.Y4(PS_DDR_DQ27_502)
DDR3_D28: U?#1.D7(DQ8) U?#3.Y2(PS_DDR_DQ28_502)
DDR3_D29: U?#1.C3(DQ9) U?#3.W3(PS_DDR_DQ29_502)
DDR3_D30: U?#1.A3(DQ15) U?#3.V2(PS_DDR_DQ30_502)
DDR3_D31: U?#1.A2(DQ13) U?#3.V3(PS_DDR_DQ31_502)
DDR3_DM0: U?#2.E7(LDM) U?#3.A1(PS_DDR_DM0_502)
DDR3_DM1: U?#2.D3(UDM) U?#3.F1(PS_DDR_DM1_502)
DDR3_DM2: U?#1.E7(LDM) U?#3.T1(PS_DDR_DM2_502)
DDR3_DM3: U?#1.D3(UDM) U?#3.Y1(PS_DDR_DM3_502)
DDR3_DQS0_N: U?#2.B7(~{UDQS}) U?#2.G3(~{LDQS}) U?#3.B2(PS_DDR_DQS_N0_502)
DDR3_DQS0_P: U?#2.C7(UDQS) U?#2.F3(LDQS) U?#3.C2(PS_DDR_DQS_P0_502)
DDR3_DQS1_N: U?#3.F2(PS_DDR_DQS_N1_502)
DDR3_DQS1_P: U?#3.G2(PS_DDR_DQS_P1_502)
DDR3_DQS2_N: U?#1.G3(~{LDQS}) U?#3.T2(PS_DDR_DQS_N2_502)
DDR3_DQS2_P: U?#1.F3(LDQS) U?#3.R2(PS_DDR_DQS_P2_502)
DDR3_DQS3_N: U?#1.B7(~{UDQS}) U?#3.W4(PS_DDR_DQS_N3_502)
DDR3_DQS3_P: U?#1.C7(UDQS) U?#3.W5(PS_DDR_DQS_P3_502)
DDR3_ODT: R?#23.2 U?#1.K1(ODT) U?#2.K1(ODT) U?#3.N5(PS_DDR_ODT_502)
DDR3_RAS: R?#20.2 U?#1.J3(~{RAS}) U?#2.J3(~{RAS}) U?#3.P4(PS_DDR_RAS_B_502)
DDR3_RESET: R?#29.2 R?#30.2 U?#1.T2(RESET#) U?#2.T2(RESET#) U?#3.B4(PS_DDR_DRST_B_502)
DDR3_S0: R?#19.2 U?#1.L2(~{CS}) U?#2.L2(~{CS}) U?#3.N1(PS_DDR_CS_B_502)
DDR3_VRN: R?#27.1 U?#3.G5(PS_DDR_VRN_502)
DDR3_VRP: R?#25.1 U?#3.H5(PS_DDR_VRP_502)
DDR3_WE: R?#22.2 U?#1.L3(~{WE}) U?#2.L3(~{WE}) U?#3.M5(PS_DDR_WE_B_502)
EECLK: R11.1 U2.44(EECLK) U6.2(CLK)
EECS: R10.1 U2.45(EECS) U6.1(CS)
EEDATA: R12.1 R13.2 U2.43(EEDATA) U6.3(DI)
ETH_MDC: U1C.C10(PS_MIO52-501)
ETH_MDIO: U1C.C11(PS_MIO53-501)
ETH_RXCK: U1C.B17(PS_MIO22-501)
ETH_RXCTL: U1C.D13(PS_MIO27-501)
ETH_RXD0: U1C.D11(PS_MIO23-501)
ETH_RXD1: U1C.A16(PS_MIO24-501)
ETH_RXD2: U1C.F15(PS_MIO25-501)
ETH_RXD3: U1C.A15(PS_MIO26-501)
ETH_TXCK: U1C.A19(PS_MIO16-501)
ETH_TXCTL: U1C.F14(PS_MIO21-501)
ETH_TXD0: U1C.E14(PS_MIO17-501)
ETH_TXD1: U1C.B18(PS_MIO18-501)
ETH_TXD2: U1C.D10(PS_MIO19-501)
ETH_TXD3: U1C.A17(PS_MIO20-501)
FPGA_DONE: U1A.R11(DONE_0)
FPGA_TCK: R4.2 U1A.F9(TCK_0)
FPGA_TDI: R5.2 U1A.G6(TDI_0)
FPGA_TDO: R135.2 U1A.F6(TDO_0)
FPGA_TMS: R6.2 U1A.J6(TMS_0)
IO1_12P: R29.2
MIO0_LED: U1B.E6(PS_MIO0_500)
MIO13_LED: U1B.E8(PS_MIO13_500)
MIO_KEY1: U1C.B13(PS_MIO50-501)
MIO_KEY2: U1C.B9(PS_MIO51-501)
OTG_CLK: U1C.A11(PS_MIO36-501)
OTG_DATA0: U1C.A14(PS_MIO32-501)
OTG_DATA1: U1C.D15(PS_MIO33-501)
OTG_DATA2: U1C.A12(PS_MIO34-501)
OTG_DATA3: U1C.F12(PS_MIO35-501)
OTG_DATA4: U1C.C16(PS_MIO28-501)
OTG_DATA5: U1C.A10(PS_MIO37-501)
OTG_DATA6: U1C.E13(PS_MIO38-501)
OTG_DATA7: U1C.C18(PS_MIO39-501)
OTG_DIR: U1C.C13(PS_MIO29-501)
OTG_NXT: U1C.E16(PS_MIO31-501)
OTG_RESETN: U1C.D16(PS_MIO46-501)
OTG_STP: U1C.C15(PS_MIO30-501)
PL_GCLK: R158.2 U1F.U15(IO_L11N_T1_SRCC_34)
PS_MIO7: R19.2 U1B.D8(PS_MIO7_500)
PS_MIO8: R15.2 U1B.D5(PS_MIO8_500)
PS_MIO9: U1B.B5(PS_MIO9_500)
PS_MIO10: U1B.E9(PS_MIO10_500)
PS_MIO11: U1B.C6(PS_MIO11_500)
PS_MIO12: U1B.D9(PS_MIO12_500)
PS_MIO14: U1B.C5(PS_MIO14_500)
PS_MIO15: U1B.C8(PS_MIO15_500)
PS_POR_B: R27.1 U1B.C7(PS_POR_B_500) U7.2(#RESET)
PS_SRST_B: R28.1 U1C.B10(PS_SRST_B_501)
QSPI_CLK: R14.1
QSPI_CS: U1B.A7(PS_MIO1_500)
QSPI_D0: R16.2 U1B.B8(PS_MIO2_500)
QSPI_D1: R17.2 U1B.D6(PS_MIO3_500)
QSPI_D2: R23.2 U1B.B7(PS_MIO4_500)
QSPI_D3: R24.2 U1B.A6(PS_MIO5_500)
QSPI_SCK: R18.2
SD_CD: U1C.B14(PS_MIO47-501)
SD_CLK: R87.2
SD_CMD: U1C.C17(PS_MIO41-501)
SD_D0: U1C.E12(PS_MIO42-501)
SD_D1: U1C.A9(PS_MIO43-501)
SD_D2: U1C.F13(PS_MIO44-501)
SD_D3: U1C.B15(PS_MIO45-501)
UART_RX: U1C.C12(PS_MIO49-501)
UART_TX: U1C.B12(PS_MIO48-501)
Net?_1: ?.1 C?#94.2 C?#95.2 U?#4.G8(VCCPLL)
NetC8_1: C8.1 U2.38(VCCCORE)
NetC10_2: C10.2 R7.2 U2.34(RESET)
NetC13_1: C13.1 U2.1(XCSI) Y1.1(OSC1)
NetC14_1: C14.1 U2.2(XCSO) Y1.2(OSC2)
NetC18_2: C18.2 C19.2 C20.2 L5.1
NetC26_2: C26.2 R25.1 R26.2 U1C.E11(PS_MIO_VREF_501)
NetC?#8_1: C?#8.1 C?#16.2
NetC?#9_1: C?#9.1 C?#17.2
NetC?#119_2: C?#119.2 R?#32.2 R?#33.1 U?#6.1(REFIN)
NetC_9_2: C_9.2 U2.37(VCCA)
NetJ1_2: J1.2(D-) U2.6(DM)
NetJ1_3: J1.3(D+) U2.7(DP)
NetJ13_1: J13.1 R22.1 R24.1
NetJ13_3: J13.3 R21.1 R23.1
NetKEY1_2: KEY1.2(P2) U7.3(#MR)
NetR1_1: R1.1 U1A.R10(INIT_B_0)
NetR2_1: R2.1 U1A.L6(PROGRAM_B_0)
NetR4_1: R4.1 U2.13(ADBUS0/TCK)
NetR5_1: R5.1 U2.14(ADBUS1/TDI)
NetR6_1: R6.1 U2.16(ADBUS3/TMS)
NetR8_2: R8.2 U2.5(REF)
NetR13_1: R13.1 U6.4(DO)
NetR14_2: R14.2 U1B.A5(PS_MIO6_500)
NetR20_1: R20.1 U1B.E7(PS_CLK_500)
NetR20_2: R20.2 X1.3(OUT)
NetR87_1: R87.1 U1C.D14(PS_MIO40-501)
NetR135_1: R135.1 U2.15(ADBUS2/TDO)
NetR158_1: R158.1 X3.3(OUT)
NetR?#26_2: R?#26.2 U?#1.L8(ZQ)
NetR?#28_2: R?#28.2 U?#2.L8(ZQ)
NetR?#34_1: R?#34.1 U?#6.9(PGOOD)
NetU?#1_A1: U?#1.A1(ADDQ1) U?#1.A8(ADDQ2) U?#1.C1(ADDQ3) U?#1.C9(ADDQ4) U?#1.D2(ADDQ5) U?#1.D9(VDD2) U?#1.E9(ADDQ6) U?#1.F1(ADDQ7) U?#1.G7(VDD3) U?#1.H2(ADDQ8) U?#1.H9(ADDQ9) U?#1.K2(VDD4) U?#1.K8(VDD5) U?#1.N1(VDD6) U?#1.N9(VDD7) U?#1.R1(VDD8) U?#1.R9(VDD9)
NetU?#2_A1: U?#2.A1(ADDQ1) U?#2.A8(ADDQ2) U?#2.C1(ADDQ3) U?#2.C9(ADDQ4) U?#2.D2(ADDQ5) U?#2.D9(VDD2) U?#2.E9(ADDQ6) U?#2.F1(ADDQ7) U?#2.G7(VDD3) U?#2.H2(ADDQ8) U?#2.H9(ADDQ9) U?#2.K2(VDD4) U?#2.K8(VDD5) U?#2.N1(VDD6) U?#2.N9(VDD7) U?#2.R1(VDD8) U?#2.R9(VDD9)

Not connected (* = marked no-connect by the designer): J1 4(ID); U1A K9(VP_0) L10(VN_0); U1E T5(IO_L19P_T3_13) T9(IO_L12P_T1_MRCC_13) U5(IO_L19N_T3_VREF_13) U7(IO_L11P_T1_SRCC_13) U8(IO_L17N_T2_13) U9(IO_L17P_T2_13) U10(IO_L12N_T1_MRCC_13) V5(IO_L6N_T0_VREF_13) V6(IO_L22P_T3_13) V7(IO_L11N_T1_SRCC_13) V8(IO_L15P_T2_DQS_13) V10(IO_L21N_T3_DQS_13) V11(IO_L21P_T3_DQS_13) W6(IO_L22N_T3_13) W8(IO_L15N_T2_DQS_13) W9(IO_L16N_T2_13) W10(IO_L16P_T2_13) W11(IO_L18P_T2_13) Y6(IO_L13N_T2_MRCC_13) Y7(IO_L13P_T2_MRCC_13) Y8(IO_L14N_T2_SRCC_13) Y9(IO_L14P_T2_SRCC_13) Y11(IO_L18N_T2_13) Y12(IO_L20P_T3_13) Y13(IO_L20N_T3_13); U1F N17(IO_L23P-T3_34) N18(IO_L13P_T2_MRCC_34) N20(IO_L14P_T2_SRCC_34) P14(IO_L6P_T0_34) P15(IO_L24P-T3_34) P16(IO_L24N-T3_34) P18(IO_L23N-T3_34) P19(IO_L13N_T2_MRCC_34) P20(IO_L14N_T2_SRCC_34) R14(IO_L6N_T0_34) R16(IO_L19P_T2_34) R17(IO_L19N_T3_VREF_34) R18(IO_L20N_T3-34) R19(IO_0_34) T10(IO_L1N_T0_34) T11(IO_L1P_T0_34) T12(IO_L2P_T0_34) T14(IO_L5P_T0_34) T15(IO_L5N_T0_34) T16(IO_L9P_T1_DQS_34) T17(IO_L20P_T3-34) T19(IO_24_34) T20(IO_L15P_T2_DQS_34) U12(IO_L2N_T0_34) U13(IO_L3P_T0_DQS_PUDC_B_34) U14(IO_L11P_T1_SRCC_34) U17(IO_L9N_T1_DQS_34) U18(IO_L12P_T1_MRCC_34) U19(IO_L12N_T1_MRCC_34) U20(IO_L15N_T2_DQS_34) V12(IO_L4P_T0_34) V13(IO_L3N_T0_DQS_B_34) V15(IO_L10P_T1_34) V16(IO_L18P_T2_34) V17(IO_L21P_T3_DQS_34) V18(IO_L21N_T3_DQS_34) V20(IO_L16P_T2_34) W13(IO_L4N_T0_34) W14(IO_L8P_T1_34) W15(IO_L10N_T1_34) W16(IO_L18N_T2_34) W18(IO_L222P-T3_34) W19(IO_L222N-T3_34) W20(IO_L16N_T2_34) Y14(IO_L8N_T1_34) Y16(IO_L7P_T1_34) Y17(IO_L7N_T1_34) Y18(IO_L17P_T2_34) Y19(IO_L17N_T2_34); U1G A20(IO_L2N_T0_AD8N_35) B19(IO_L2P_T0_AD8P_35) B20(IO_L1N_T0_AD0N_35) C20(IO_L1P_T0_AD0P_35) D18(IO_L3N_T0_DQS_AD1N_35) D19(IO_L4P_T0_35) D20(IO_L4N_T0_35) E17(IO_L3P_T0_DQS_AD1P_35) E18(IO_L5P_T0_AD9P_35) E19(IO_L5N_T0_AD9N_35) F16(IO_L6P_T0_35) F17(IO_L6N_T0_VREF_35) F19(IO_L15P_T2_DQS_AD12P_35) F20(IO_L15N_T2_DQS_AD12N_35) G14(IO_0_35) G15(IO_L19N_T3_VREF_35) G17(IO_L16P_T2_35) G18(IO_L16N_T2_35) G19(IO_L18P_T2_AD13P_35) G20(IO_L18N_T2_AD13N_35) H15(IO_L19P_T3_35) H16(IO_L13P_T2_MRCC_35) H17(IO_L13N_T2_MRCC_35) H18(IO_L14N_T2_AD4N_SRCC_35) H20(IO_L17N_T2_AD5N_35) J14(IO_L20N_T3_AD6N_35) J15(IO_25_35) J16(IO_L24N_T3_AD15N_35) J18(IO_L14P_T2_AD4P_SRCC_35) J19(IO_L10N_T1_AD11N_35) J20(IO_L17P_T2_AD5P_35) K14(IO_L20P_T3_AD6P_35) K16(IO_L24P_T3_AD15P_35) K17(IO_L12P_T1_MRCC_35) K18(IO_L12N_T1_MRCC_35) K19(IO_L10P_T1_AD11P_35) L14(IO_L22P_T3_AD7P_35) L15(IO_L22N_T3_AD7N_35) L16(IO_L11P_T1_SRCC_35) L17(IO_L11N_T1_SRCC_35) L19(IO_L9P_T1_DQS_AD3P_35) L20(IO_L9N_T1_DQS_AD3N_35) M14(IO_L23P_T3_35) M15(IO_L23N_T3_35) M17(IO_L8P_T1_AD10P_35) M18(IO_L8N_T1_AD10N_35) M19(IO_L7P_T1_AD2P_35) M20(IO_L7N_T1_AD2N_35) N15(IO_L21P_T3_DQS_AD14P_35) N16(IO_L21N_T3_DQS_AD14N_35); U2 17(ADBUS4) 18(ADBUS5) 19(ADBUS6) 20(ADBUS7) 21(ACBUS0) 25(ACBUS1) 26(ACBUS2) 27(ACBUS3) 28(ACBUS4) 29(ACBUS5) 30(ACBUS6) 31(ACBUS7) 32(ACBUS8) 33(ACBUS9); U6 6(NC2) 7(NC1); U?#1 J1(NC1) J9(NC2) L1(NC3) L9(NC4) M7(NC5); U?#2 J1(NC1) J9(NC2) L1(NC3) L9(NC4) M7(NC5)

## Notes on the sheet
- 5页
- 3页
- 4 页
- 6页
- 7页
- 8页
- (near C?#12) VCCINT
- (near C?#26) VCCO_13
- (near C?#32) VCC_PAUX
- (near C?#39) VCCO_34
- (near C?#46) VCC_AUX
- (near C?#52) VCCO_35
- (near C?#65) VCCO_DDR_502
- (near C?#59) VCC_BRAM
- (near C?#75) VCCO_MIO0_500
- (near C?#79) VCCO_MIO0_501
- (near C?#88) VCCPINT
- DDR POWER For VTT/VREF
- (in symbol BANK13) (Z7020 only)

## Library data of the parts
? = Component_1
C1 C2 C4 C8 C10 C13-C27 C238 C_7 C_9 = C
C?#1-C?#146 = Cap: Capacitor; Published: 8-Jun-2000; LatestRevisionDate: 17-Jul-2002; LatestRevisionNote: Re-released for DXP Platform.; PackageReference: RAD-0.3; Publisher: Altium Limited; PackageDescription: Radial Cap, Thru-Hole; 2 Leads; 0.3 in Pin Spacing
J13 = Header 4: Header, 4-Pin; LatestRevisionDate: 17-Jul-2002; LatestRevisionNote: Re-released for DXP Platform.; Publisher: Altium Limited
KEY1 = BUTTON2
L1-L5 = L
R1 R2 R4-R8 R10-R29 R87 R135 R158 = R
R?#1-R?#34 = Res1: Resistor; Published: 8-Jun-2000; LatestRevisionDate: 17-Jul-2002; LatestRevisionNote: Re-released for DXP Platform.; PackageReference: AXIAL-0.3; Publisher: Altium Limited; PackageDescription: Axial Device, Thru-Hole; 2 Leads; 0.3 in Pin Spacing
U1A = BANK0
U1B = BANK500
U1C = BANK510
U1E = BANK13
U1F = BANK34
U1G = BANK35
Y1 = XTAL: Crystal Oscillator; Published: 8-Jun-2000; LatestRevisionDate: 17-Jul-2002; LatestRevisionNote: Re-released for DXP Platform.; Publisher: Altium Limited